# Altium project receiver.PrjPcb
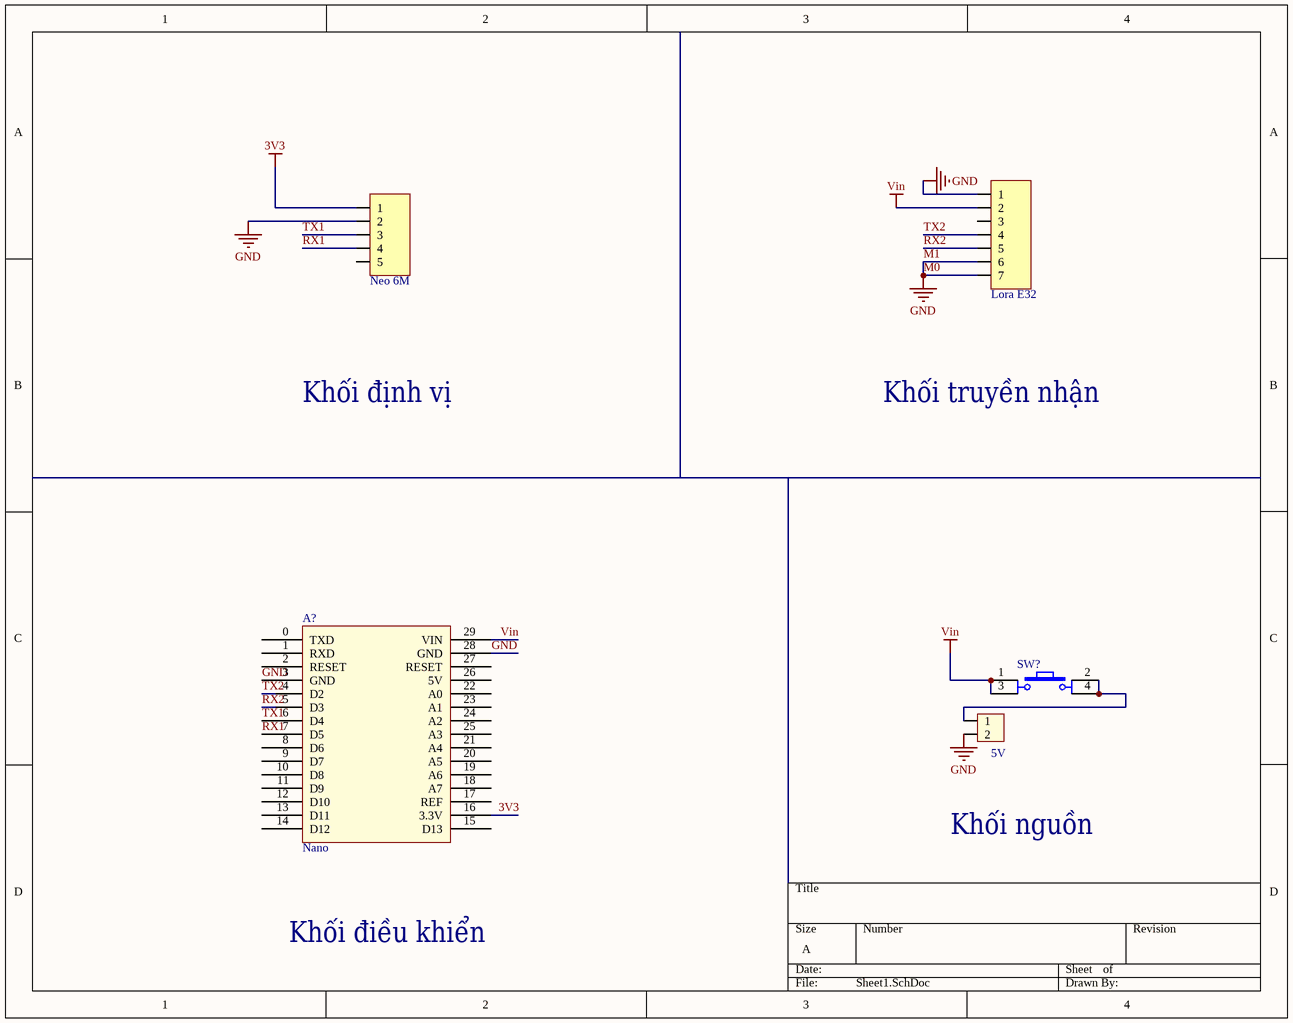
[diagram p0: Sheet1.SchDoc]
1 sheet, 5 parts. Net scope: global (net labels, ports and power ports of the same name join across sheets).
Board file: receiver.PcbDoc

## Sheet Sheet1.SchDoc
size A; SheetNumber: 1; SheetTotal: 1

### Parts
5V  Header 2P 2.54 Duc Thang  [XH2.54M-2]  (value not drawn)
GPS  Neo 6M  [JP 1x5 CT]
Lora  Lora E32  [JP 1x7 CT]
Nano  Nano  [Arduino nano]
SW?  INI PUSH BUTTON SWITCH 4-PIN  [SW_70_31.5D47_TH_ST]  (value not drawn)

### Nets
3V3: GPS.1 Nano.16(3.3V)
GND: 5V.2 GPS.2 Lora.1 Lora.6 Lora.7 Nano.3(GND) Nano.28(GND)  [also labelled M0, M1]
Vin: Lora.2 Nano.29(VIN) SW?.1 SW?.3
RX1: GPS.4 Nano.7(D5)
RX2: Lora.5 Nano.5(D3)
TX1: GPS.3 Nano.6(D4)
TX2: Lora.4 Nano.4(D2)
Net5V_1: 5V.1 SW?.2 SW?.4

Not connected (* = marked no-connect by the designer): GPS 5; Lora 3; Nano 0(TXD) 1(RXD) 2(RESET) 8(D6) 9(D7) 10(D8) 11(D9) 12(D10) 13(D11) 14(D12) 15(D13) 17(REF) 18(A7) 19(A6) 20(A5) 21(A4) 22(A0) 23(A1) 24(A2) 25(A3) 26(5V) 27(RESET)

### Notes on the sheet
- Khối định vị
- Khối truyền nhận
- Khối nguồn
- Khối điều khiển

### Library data of the parts
5V = Header 2P 2.54 Duc Thang: Cắm; Ten_Linh_Kien: Header 2P XH2.54-2P Đực Thẳng; Don_Vi: Con; Ma_Hang: MH001283; Chung_Loai: Cắm
GPS = JP 1x5 2.54 Cai Thang: Cắm; Ten_Linh_Kien: Jump Đơn Cái 2.54MM 1x20P Thẳng; Don_Vi: Con; Ma_Hang: MH004006
Lora = JP 1x7 2.54 Cai Thang: Cắm; Ten_Linh_Kien: Jump Đơn Cái 2.54MM 1x20P Thẳng; Don_Vi: Con; Ma_Hang: MH004006
Nano = Arduino Nano
SW? = SW2_BUTT-4-TH: Tactile Switches MINI PUSH BUTTON SWITCH 4-PIN QTY. 4; Manufacturer: Gravitech; Manufacturer Part Number: BUTT-4; Alternate Part Number-1: NA; Case/Package: TH; Supplier-1: SP ROAD; Supplier Part Number-1: BUTT-4